# Altium project S7CAS-PLEIADES-CARTE-MERE_P20.PrjPcb (part 4 of 5)

## Sheet S7CAS-PLEIADES-CARTE-MERE_P20_ADC.SchDoc
size Tabloid; SheetNumber: 16; SheetTotal: 20; Sheet_Name: ADC; Size: 11x17
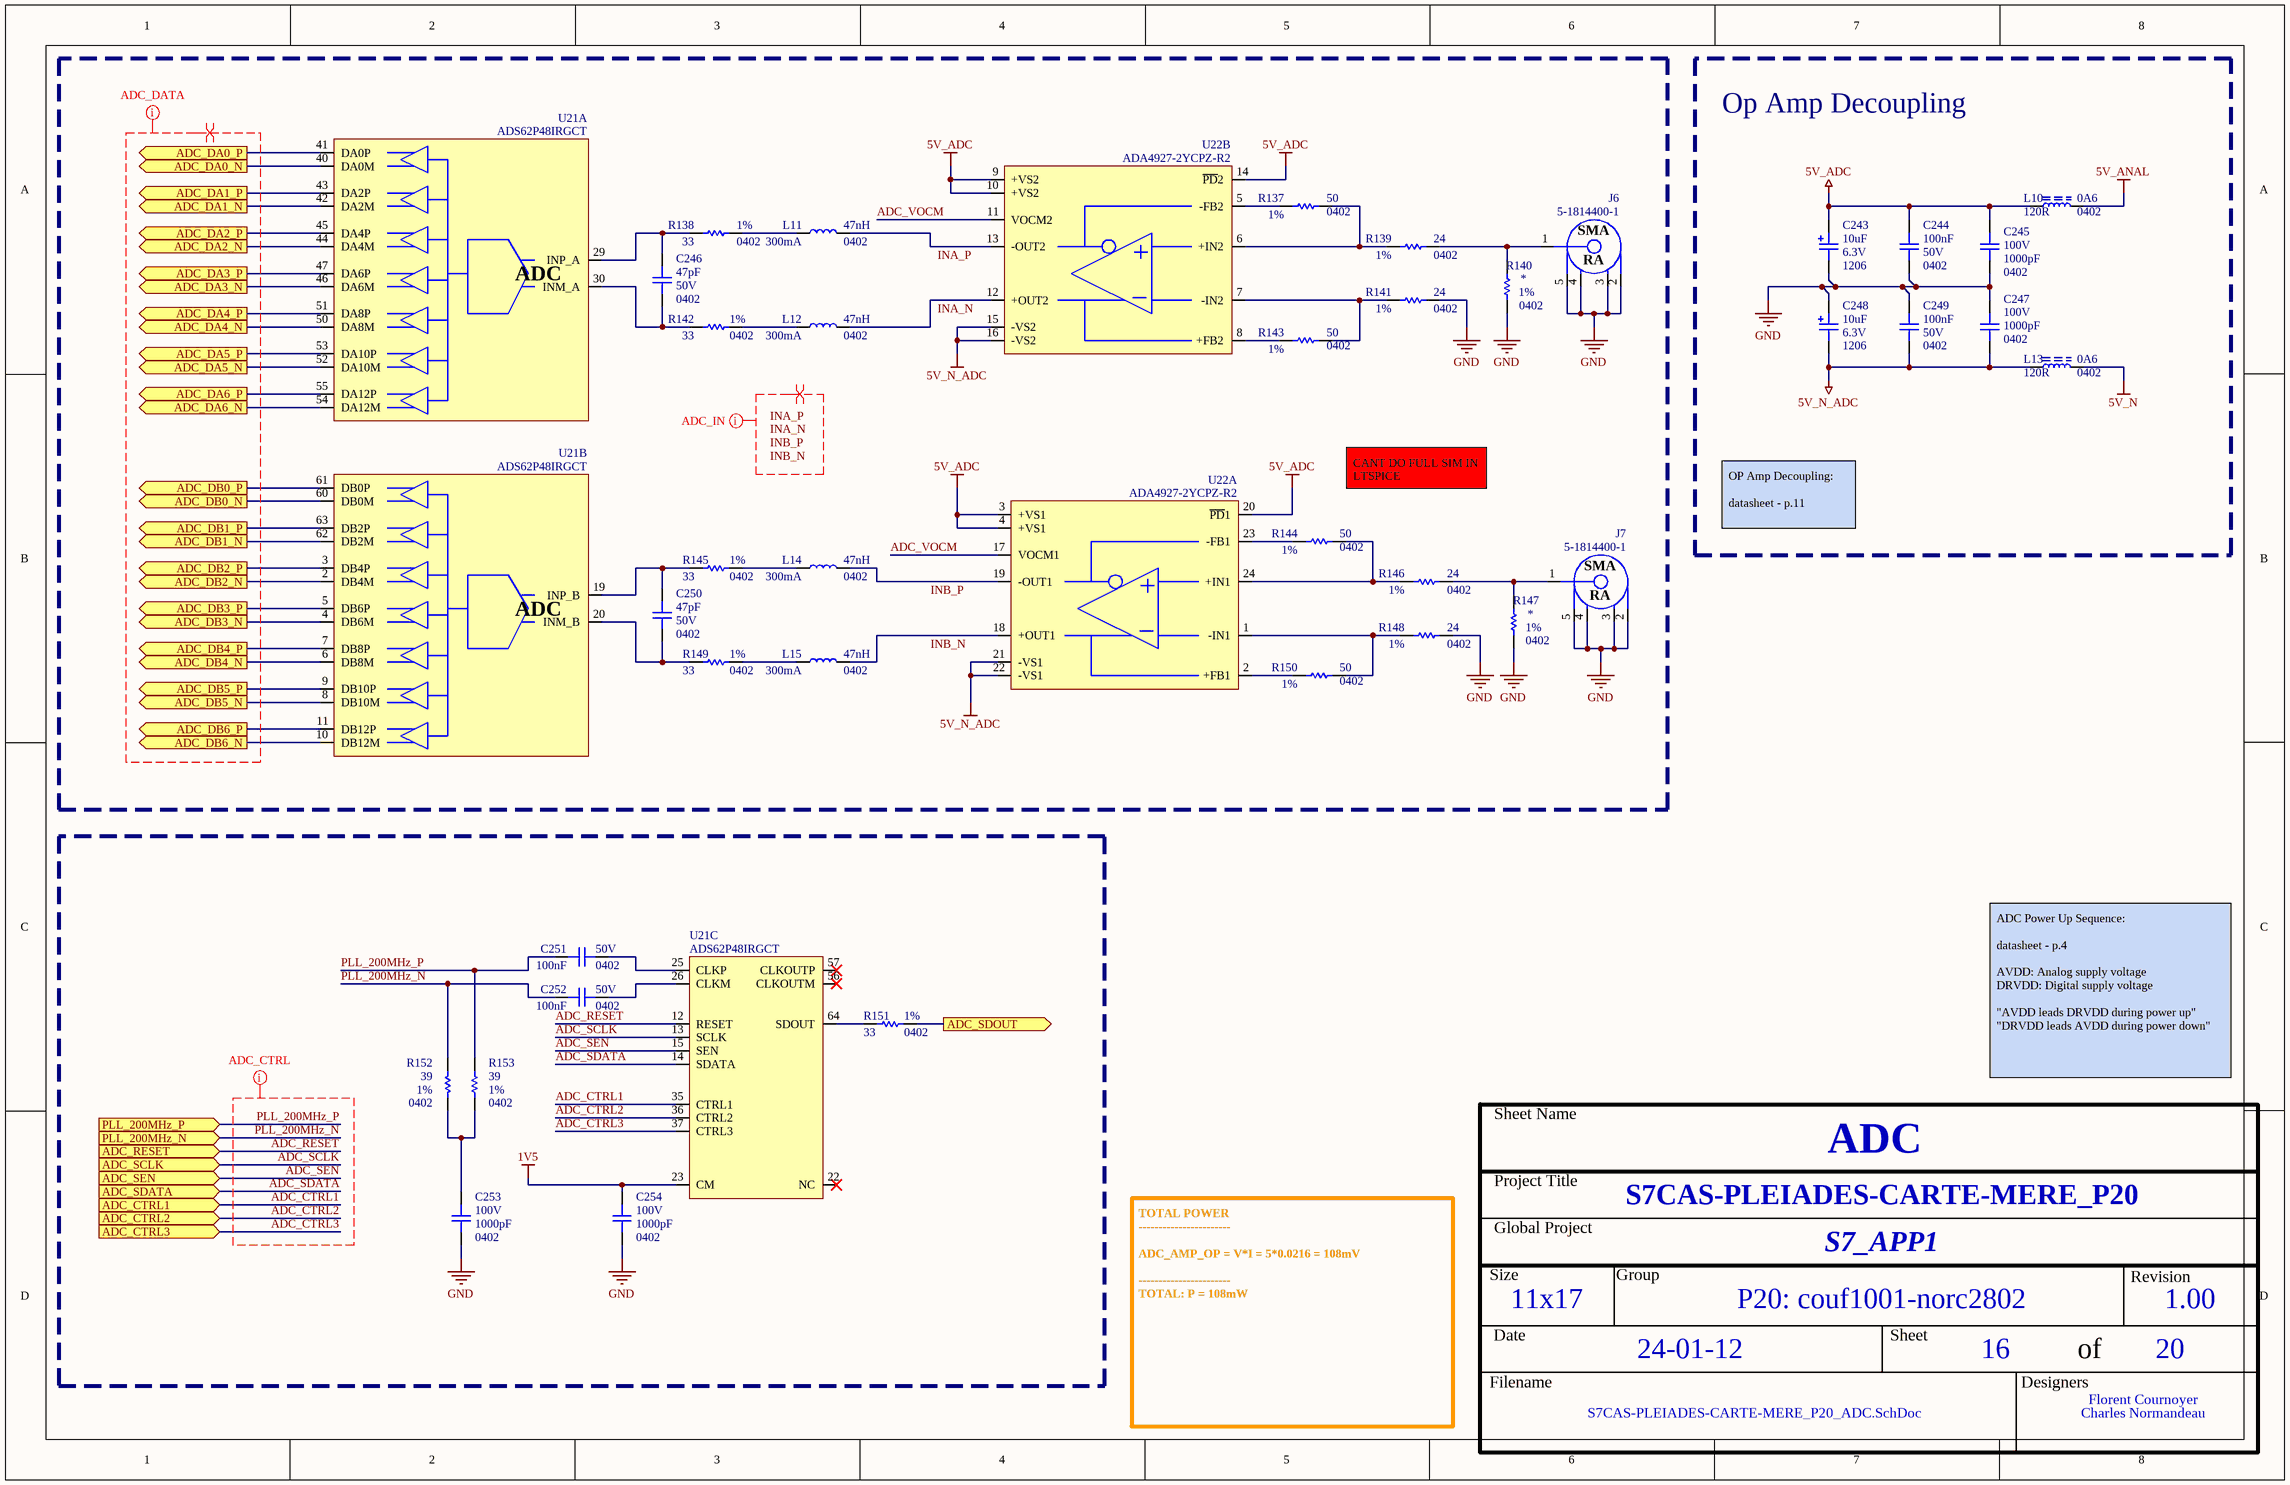
[diagram p15: S7CAS-PLEIADES-CARTE-MERE_P20_ADC.SchDoc]

### Parts
C243  value 10uF  Voltage: 6.3V  Package: 1206  [CAP_TAN_1206(A)]  (hidden comment: CAP - TANTALUM - CASE A)
C244  value 100nF  Voltage: 50V  Package: 0402  [CAP_0402]  (hidden comment: CAP - 0402)
C245  value 1000pF  Voltage: 100V  Package: 0402  [CAP_0402]  (hidden comment: CAP - 0402)
C246  value 47pF  Voltage: 50V  Package: 0402  [CAP_0402]  (hidden comment: CAP - 0402)
C247  value 1000pF  Voltage: 100V  Package: 0402  [CAP_0402]  (hidden comment: CAP - 0402)
C248  value 10uF  Voltage: 6.3V  Package: 1206  [CAP_TAN_1206(A)]  (hidden comment: CAP - TANTALUM - CASE A)
C249  value 100nF  Voltage: 50V  Package: 0402  [CAP_0402]  (hidden comment: CAP - 0402)
C250  value 47pF  Voltage: 50V  Package: 0402  [CAP_0402]  (hidden comment: CAP - 0402)
C251  value 100nF  Voltage: 50V  Package: 0402  [CAP_0402]  (hidden comment: CAP - 0402)
C252  value 100nF  Voltage: 50V  Package: 0402  [CAP_0402]  (hidden comment: CAP - 0402)
C253  value 1000pF  Voltage: 100V  Package: 0402  [CAP_0402]  (hidden comment: CAP - 0402)
C254  value 1000pF  Voltage: 100V  Package: 0402  [CAP_0402]  (hidden comment: CAP - 0402)
J6  5-1814400-1  [CONN_SMA_5-1814400-1]
J7  5-1814400-1  [CONN_SMA_5-1814400-1]
L10  value 120R  Current: 0A6  Package: 0402  [FER_0402]  (hidden comment: FER - 0402)
L11  value 47nH  Current: 300mA  Package: 0402  [IND_0402]  (hidden comment: Part Number)
L12  value 47nH  Current: 300mA  Package: 0402  [IND_0402]  (hidden comment: Part Number)
L13  value 120R  Current: 0A6  Package: 0402  [FER_0402]  (hidden comment: FER - 0402)
L14  value 47nH  Current: 300mA  Package: 0402  [IND_0402]  (hidden comment: Part Number)
L15  value 47nH  Current: 300mA  Package: 0402  [IND_0402]  (hidden comment: Part Number)
R137  value 50  Package: 0402  Precision: 1%  [RES_0402]  (hidden comment: RES - 0402)
R138  value 33  Package: 0402  Precision: 1%  [RES_0402]  (hidden comment: RES - 0402)
R139  value 24  Package: 0402  Precision: 1%  [RES_0402]  (hidden comment: RES - 0402)
R140  Package: 0402  Precision: 1%  [RES_0402]  (hidden comment: RES - 0402)
R141  value 24  Package: 0402  Precision: 1%  [RES_0402]  (hidden comment: RES - 0402)
R142  value 33  Package: 0402  Precision: 1%  [RES_0402]  (hidden comment: RES - 0402)
R143  value 50  Package: 0402  Precision: 1%  [RES_0402]  (hidden comment: RES - 0402)
R144  value 50  Package: 0402  Precision: 1%  [RES_0402]  (hidden comment: RES - 0402)
R145  value 33  Package: 0402  Precision: 1%  [RES_0402]  (hidden comment: RES - 0402)
R146  value 24  Package: 0402  Precision: 1%  [RES_0402]  (hidden comment: RES - 0402)
R147  Package: 0402  Precision: 1%  [RES_0402]  (hidden comment: RES - 0402)
R148  value 24  Package: 0402  Precision: 1%  [RES_0402]  (hidden comment: RES - 0402)
R149  value 33  Package: 0402  Precision: 1%  [RES_0402]  (hidden comment: RES - 0402)
R150  value 50  Package: 0402  Precision: 1%  [RES_0402]  (hidden comment: RES - 0402)
R151  value 33  Package: 0402  Precision: 1%  [RES_0402]  (hidden comment: RES - 0402)
R152  value 39  Package: 0402  Precision: 1%  [RES_0402]  (hidden comment: RES - 0402)
R153  value 39  Package: 0402  Precision: 1%  [RES_0402]  (hidden comment: RES - 0402)
U21  ADS62P48IRGCT  [ADC_ADS62P48IRGCT]  (parts A,B,C of 4)
U22  ADA4927-2YCPZ-R2  [OPAMP_ADA4927-2YCPZ-R2]  (parts A,B of 2)

### Blocks framed on the sheet
Op Amp Decoupling: C243-C245 C247-C249 L10 L13

### Ports
ADC_CTRL1 (in), ADC_CTRL2 (in), ADC_CTRL3 (in), ADC_DA0_N (out), ADC_DA0_P (out), ADC_DA1_N (out), ADC_DA1_P (out), ADC_DA2_N (out), ADC_DA2_P (out), ADC_DA3_N (out), ADC_DA3_P (out), ADC_DA4_N (out), ADC_DA4_P (out), ADC_DA5_N (out), ADC_DA5_P (out), ADC_DA6_N (out), ADC_DA6_P (out), ADC_DB0_N (out), ADC_DB0_P (out), ADC_DB1_N (out), ADC_DB1_P (out), ADC_DB2_N (out), ADC_DB2_P (out), ADC_DB3_N (out), ADC_DB3_P (out), ADC_DB4_N (out), ADC_DB4_P (out), ADC_DB5_N (out), ADC_DB5_P (out), ADC_DB6_N (out), ADC_DB6_P (out), ADC_RESET (in), ADC_SCLK (in), ADC_SDATA (in), ADC_SDOUT (out), ADC_SEN (in), PLL_200MHz_N (in), PLL_200MHz_P (in)

### Nets
1V5: C254.1 U21.23(CM)
5V_ADC: C243.2 C244.2 C245.1 L10.2 U22.3(+VS1) U22.4(+VS1) U22.9(+VS2) U22.10(+VS2) U22.14(~{PD}2) U22.20(~{PD}1)
5V_ANAL: L10.1
5V_N: L13.1
5V_N_ADC: C247.2 C248.1 C249.1 L13.2 U22.15(-VS2) U22.16(-VS2) U22.21(-VS1) U22.22(-VS1)
GND: C243.1 C244.1 C245.2 C247.1 C248.2 C249.2 C253.2 C254.2 J6.2 J6.3 J6.4 J6.5 J7.2 J7.3 J7.4 J7.5 R140.1 R141.1 R147.1 R148.1
ADC_CTRL1: U21.35(CTRL1) ; port ADC_CTRL1
ADC_CTRL2: U21.36(CTRL2) ; port ADC_CTRL2
ADC_CTRL3: U21.37(CTRL3) ; port ADC_CTRL3
ADC_DA0_N: U21.40(DA0M) ; port ADC_DA0_N
ADC_DA0_P: U21.41(DA0P) ; port ADC_DA0_P
ADC_DA1_N: U21.42(DA2M) ; port ADC_DA1_N
ADC_DA1_P: U21.43(DA2P) ; port ADC_DA1_P
ADC_DA2_N: U21.44(DA4M) ; port ADC_DA2_N
ADC_DA2_P: U21.45(DA4P) ; port ADC_DA2_P
ADC_DA3_N: U21.46(DA6M) ; port ADC_DA3_N
ADC_DA3_P: U21.47(DA6P) ; port ADC_DA3_P
ADC_DA4_N: U21.50(DA8M) ; port ADC_DA4_N
ADC_DA4_P: U21.51(DA8P) ; port ADC_DA4_P
ADC_DA5_N: U21.52(DA10M) ; port ADC_DA5_N
ADC_DA5_P: U21.53(DA10P) ; port ADC_DA5_P
ADC_DA6_N: U21.54(DA12M) ; port ADC_DA6_N
ADC_DA6_P: U21.55(DA12P) ; port ADC_DA6_P
ADC_DB0_N: U21.60(DB0M) ; port ADC_DB0_N
ADC_DB0_P: U21.61(DB0P) ; port ADC_DB0_P
ADC_DB1_N: U21.62(DB2M) ; port ADC_DB1_N
ADC_DB1_P: U21.63(DB2P) ; port ADC_DB1_P
ADC_DB2_N: U21.2(DB4M) ; port ADC_DB2_N
ADC_DB2_P: U21.3(DB4P) ; port ADC_DB2_P
ADC_DB3_N: U21.4(DB6M) ; port ADC_DB3_N
ADC_DB3_P: U21.5(DB6P) ; port ADC_DB3_P
ADC_DB4_N: U21.6(DB8M) ; port ADC_DB4_N
ADC_DB4_P: U21.7(DB8P) ; port ADC_DB4_P
ADC_DB5_N: U21.8(DB10M) ; port ADC_DB5_N
ADC_DB5_P: U21.9(DB10P) ; port ADC_DB5_P
ADC_DB6_N: U21.10(DB12M) ; port ADC_DB6_N
ADC_DB6_P: U21.11(DB12P) ; port ADC_DB6_P
ADC_RESET: U21.12(RESET) ; port ADC_RESET
ADC_SCLK: U21.13(SCLK) ; port ADC_SCLK
ADC_SDATA: U21.14(SDATA) ; port ADC_SDATA
ADC_SDOUT: R151.1 ; port ADC_SDOUT
ADC_SEN: U21.15(SEN) ; port ADC_SEN
ADC_VOCM: U22.11(VOCM2) U22.17(VOCM1)
INA_N: L12.2 U22.12(+OUT2)
INA_P: L11.2 U22.13(-OUT2)
INB_N: L15.2 U22.18(+OUT1)
INB_P: L14.2 U22.19(-OUT1)
PLL_200MHz_N: C252.2 R152.2 ; port PLL_200MHz_N
PLL_200MHz_P: C251.2 R153.2 ; port PLL_200MHz_P
NetC246_1: C246.1 R142.2 U21.30(INM_A)
NetC246_2: C246.2 R138.2 U21.29(INP_A)
NetC250_1: C250.1 R149.2 U21.20(INM_B)
NetC250_2: C250.2 R145.2 U21.19(INP_B)
NetC251_1: C251.1 U21.25(CLKP)
NetC252_1: C252.1 U21.26(CLKM)
NetC253_1: C253.1 R152.1 R153.1
NetJ6_1: J6.1 R139.1 R140.2
NetJ7_1: J7.1 R146.1 R147.2
NetL11_1: L11.1 R138.1
NetL12_1: L12.1 R142.1
NetL14_1: L14.1 R145.1
NetL15_1: L15.1 R149.1
NetR137_1: R137.1 R139.2 U22.6(+IN2)
NetR137_2: R137.2 U22.5(-FB2)
NetR141_2: R141.2 R143.1 U22.7(-IN2)
NetR143_2: R143.2 U22.8(+FB2)
NetR144_1: R144.1 R146.2 U22.24(+IN1)
NetR144_2: R144.2 U22.23(-FB1)
NetR148_2: R148.2 R150.1 U22.1(-IN1)
NetR150_2: R150.2 U22.2(+FB1)
NetR151_2: R151.2 U21.64(SDOUT)

Not connected (* = marked no-connect by the designer): U21 22(NC)* 56(CLKOUTM)* 57(CLKOUTP)*

### Layout directives
net class TRACKS_50: (no net found under the mark), ADC_CTRL1, ADC_CTRL2, ADC_CTRL3, ADC_RESET, ADC_SCLK, ADC_SDATA, ADC_SEN, INA_N, INA_P, INB_N, INB_P, PLL_200MHz_N, PLL_200MHz_P
differential pair: (no net found under the mark), INA_N, INA_P, INB_N, INB_P

### Notes on the sheet
- CANT DO FULL SIM IN LTSPICE
- OP Amp Decoupling:
  datasheet - p.11
- ADC Power Up Sequence:
  datasheet - p.4
  AVDD: Analog supply voltage
  DRVDD: Digital supply voltage
  "AVDD leads DRVDD during power up"
  "DRVDD leads AVDD during power down"
- TOTAL POWER
  -----------------------
  ADC_AMP_OP = V*I = 5*0.0216 = 108mV
  -----------------------
  TOTAL: P = 108mW
- Labels drawn without touching a wire or pin: INA_N, INA_P, INB_N, INB_P
- Sheet Name
- Project Title
- Global Project
- Size
- Group
- Revision
- Date
- Sheet
- of
- Filename
- Designers
- (in symbol ADC_ADS62P48IRGCT, part A) ADC
- (in symbol ADC_ADS62P48IRGCT, part B) ADC
- (in symbol CONN_SMA_5-1814400-1) SMA; RA

### Library data of the parts
C243 C248 = CAP_TANT_1206(A): CAP - TANTALUM - 1206; Mfg Part Number: TBD; Precision: 10%; Current: *; HelpURL: TBD; CreatedBy: Jonathan Bouchard; Power: *
C244 C249 C251 C252 = CAP - 0402: Mfg Part Number: GRM155R61H104KE14; Precision: 10%; Current: *; CreatedBy: Jonathan Bouchard; Power: *
C245 C247 C253 C254 = CAP - 0402: as C226-C228 on sheet S7CAS-PLEIADES-CARTE-MERE_P20_DAC; Current: *; CreatedBy: Jonathan Bouchard; Power: *
C246 C250 = CAP - 0402: Mfg Part Number: GRM1555C1H470GA01; Precision: 10%; Current: *; CreatedBy: Jonathan Bouchard; Power: *
J6 J7 = CONN_SMA_5-1814400-1: CONN -  SMA JACK R/A 50 OHM - TH; Mfg: TE Connectivity AMP Connectors; Voltage: *; Current: *; Power: *; Mfg Part Number: 5-1814400-1; HelpURL: http://www.te.com/commerce/DocumentDelivery/DDEController?Action=srchrtrv&DocNm=1814400&DocType=Customer+Drawing&DocLang=English; CreatedBy: Jonathan Bouchard; Temperature: -55°C ~ 85°C; Value: *; Precision: *; Package: TH-5; Supplier 1: Digikey; Supplier Part Number 1: A97593-ND
L10 L13 = FER - 0402: Mfg Part Number: BLM15BX121SN1; Voltage: *; CreatedBy: Jonathan Bouchard; Power: *; Precision: *
L11 L12 L14 L15 = IND - 0402: Mfg Part Number: TBD; Voltage: *
R137 R143 R144 R150 = RES - 0402: Mfg Part Number: FC0402E50R0FTBST0; Voltage: 50V; Power: 1/16W; Current: *; CreatedBy: Jonathan Bouchard
R138 R142 R145 R149 R151 = RES - 0402: Mfg Part Number: CRCW040233R0FKEDC; Voltage: 50V; Power: 1/16W; Current: *; CreatedBy: Jonathan Bouchard
R139 R141 R146 R148 = RES - 0402: Mfg Part Number: MCS04020C2409FE000; Voltage: 50V; Power: 1/16W; Current: *; CreatedBy: Jonathan Bouchard
R140 R147 = RES - 0402: Voltage: 50V; Power: 1/16W; Current: *; CreatedBy: Jonathan Bouchard; Value: *
R152 R153 = RES - 0402: Mfg Part Number: RL0510S-390-F; Voltage: 50; Power: 1/16W; Current: *; CreatedBy: Jonathan Bouchard
U21 = ADC_ADS62P48IRGCT: ADC - 14 BIT 210MSPS SUAL - VQFN-64; Voltage: 3.15 V ~ 3.6 V / 1.7 V ~ 1.9 V; Mfg: Texas Instruments; Precision: 14 Bit; Current: *; Power: *; Mfg Part Number: ADS62P48IRGCT; HelpURL: http://www.ti.com/lit/ds/symlink/ads62p48.pdf; CreatedBy: Jonathan Bouchard; Temperature: -40°C ~ 85°C; Value: *; Package: VQFN-64; Supplier 1: Digikey; Supplier Part Number 1: 296-24611-1-ND
U22 = OPAMP_ADA4927-2YCPZ-R2: OPAMP - CFA 2.3GHZ - QFN-24; Voltage: 4.5 V ~ 11 V, ±2.25 V ~ 5.5 V; Current: 65mA; Mfg: Analog Devices; Power: *; Mfg Part Number: ADA4927-2YCPZ-R2; HelpURL: http://www.analog.com/media/en/technical-documentation/data-sheets/ADA4927-1_4927-2.pdf; CreatedBy: Jonathan Bouchard; Temperature: -40°C ~ 105°C; Value: *; Precision: *; Package: QFN-24; Supplier 1: Digikey; Supplier Part Number 1: ADA4927-2YCPZ-R2CT-ND

## Sheet S7CAS-PLEIADES-CARTE-MERE_P20_DAC-ADC-Spice-Models.SchDoc
size Tabloid; SheetNumber: 18; SheetTotal: 21; Sheet_Name: DAC ADC Spice Models; Size: 11x17
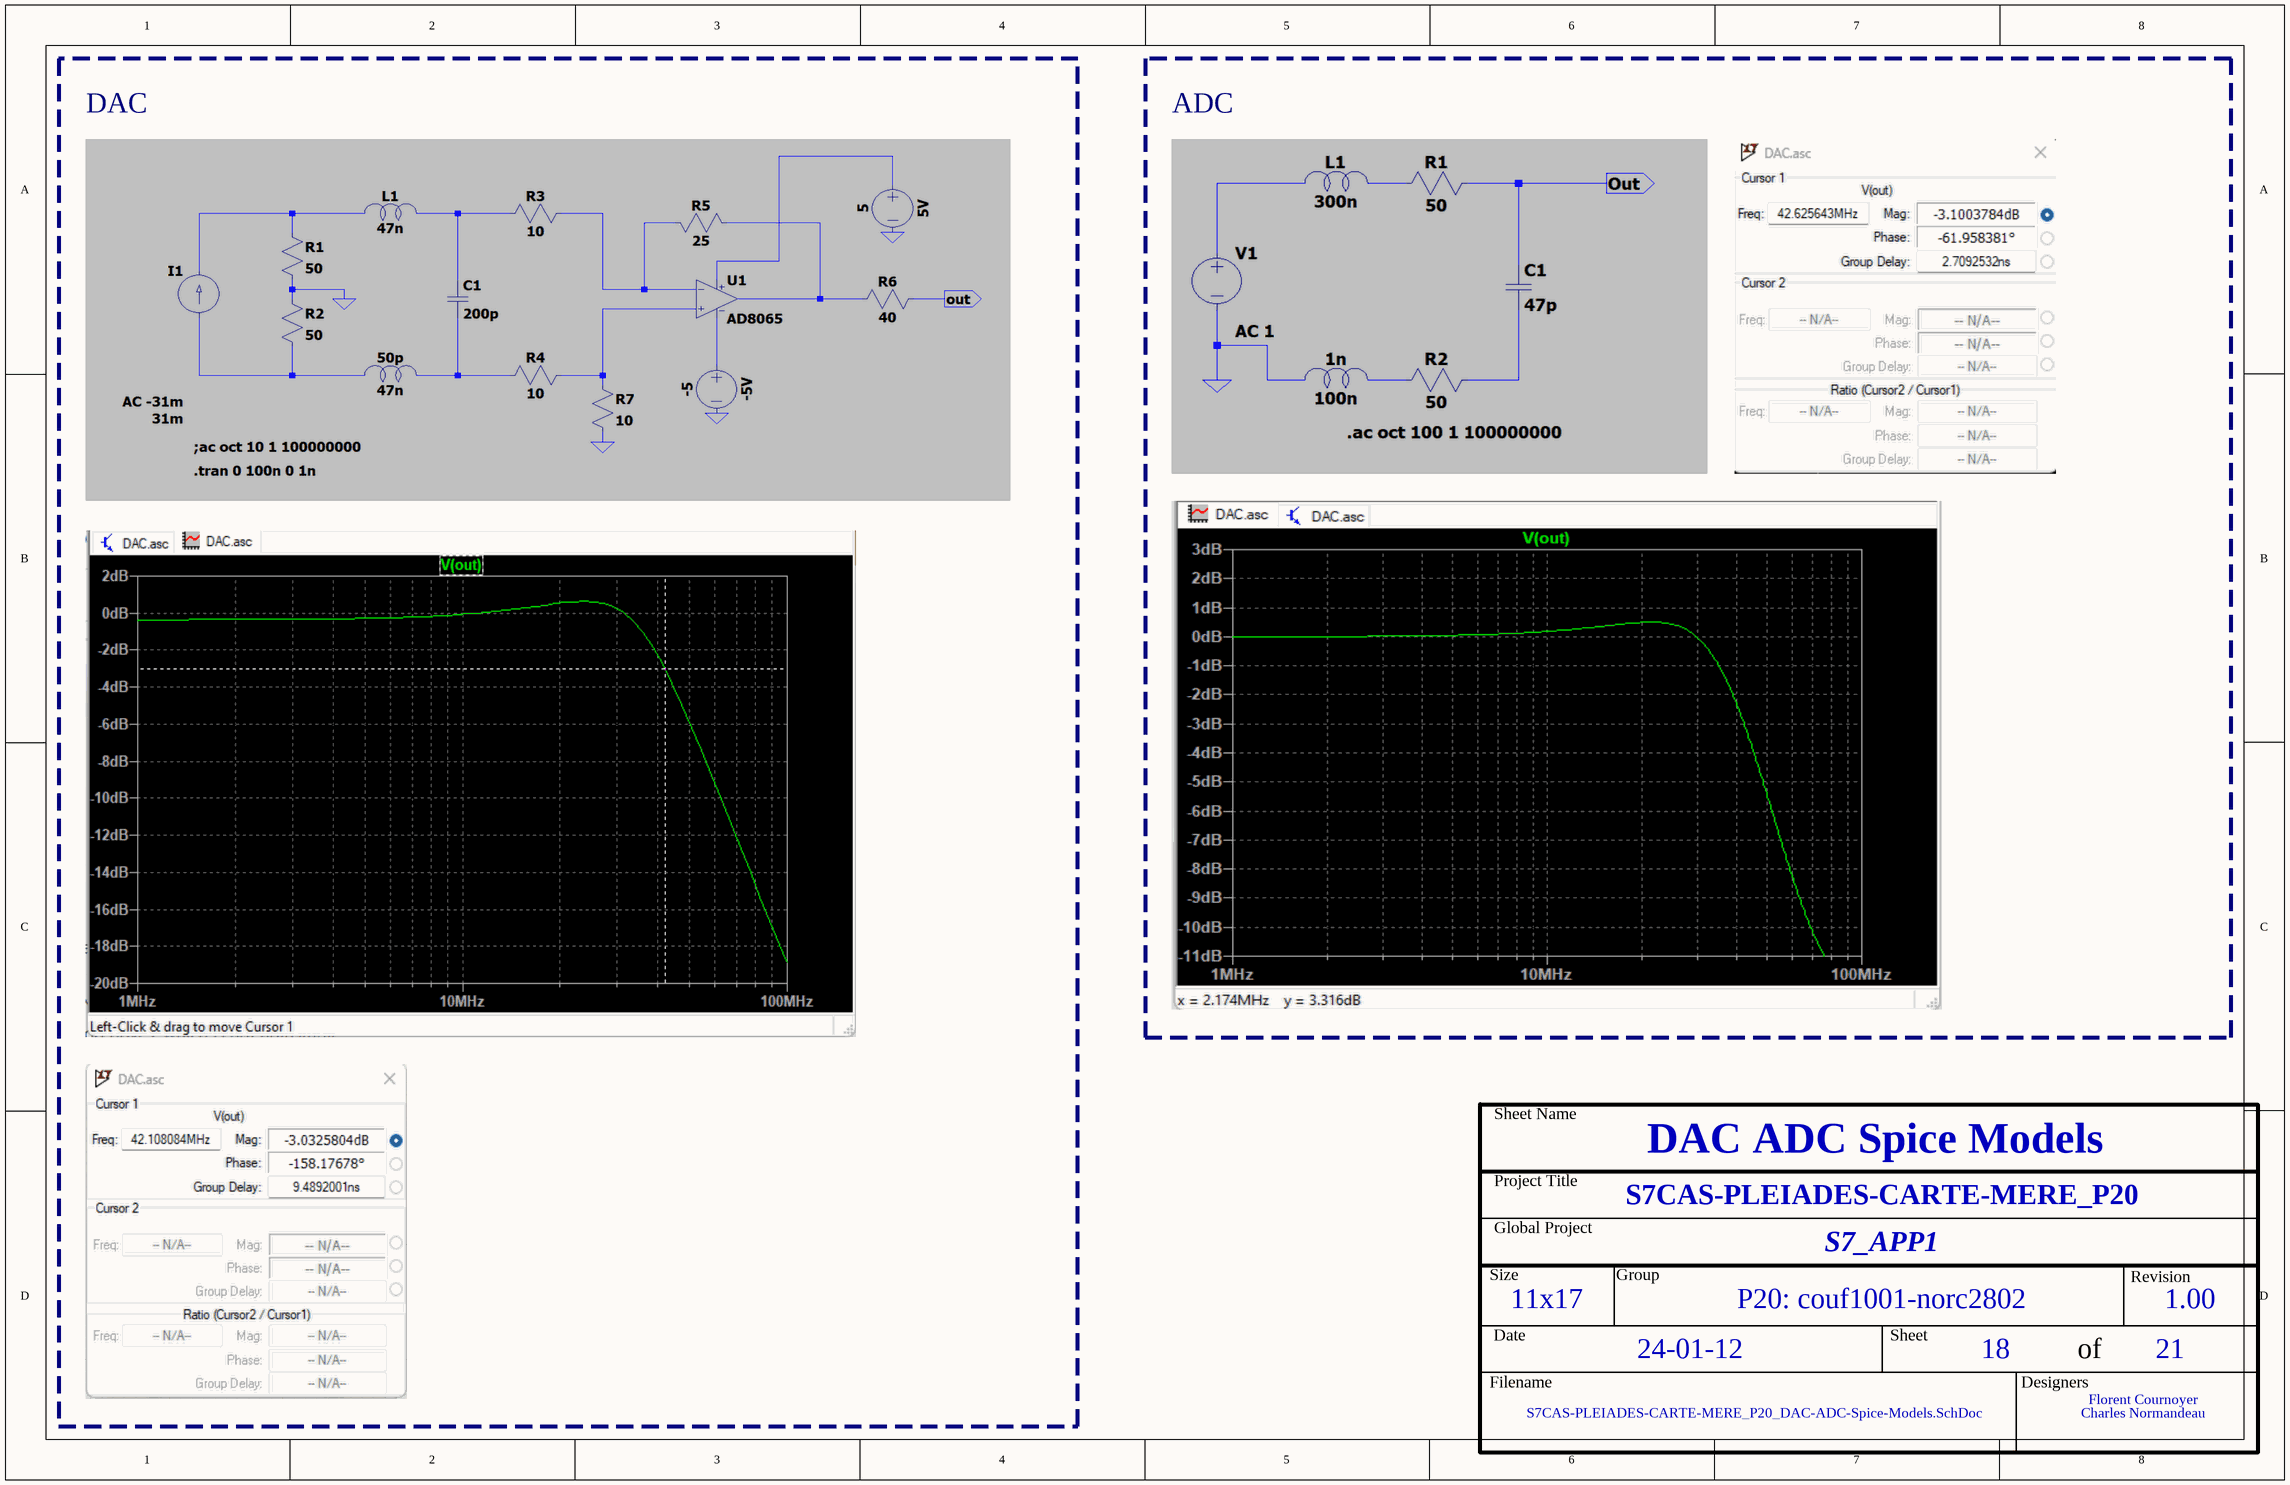
[diagram p16: S7CAS-PLEIADES-CARTE-MERE_P20_DAC-ADC-Spice-Models.SchDoc]

### Notes on the sheet
- DAC
- ADC
- Sheet Name
- Project Title
- Global Project
- Size
- Group
- Revision
- Date
- Sheet
- of
- Filename
- Designers

## Sheet S7CAS-PLEIADES-CARTE-MERE_P20_DAC-ADC-Decoupling.SchDoc
size Tabloid; SheetNumber: 18; SheetTotal: 20; Sheet_Name: DAC ADC Decoupling; Size: 11x17
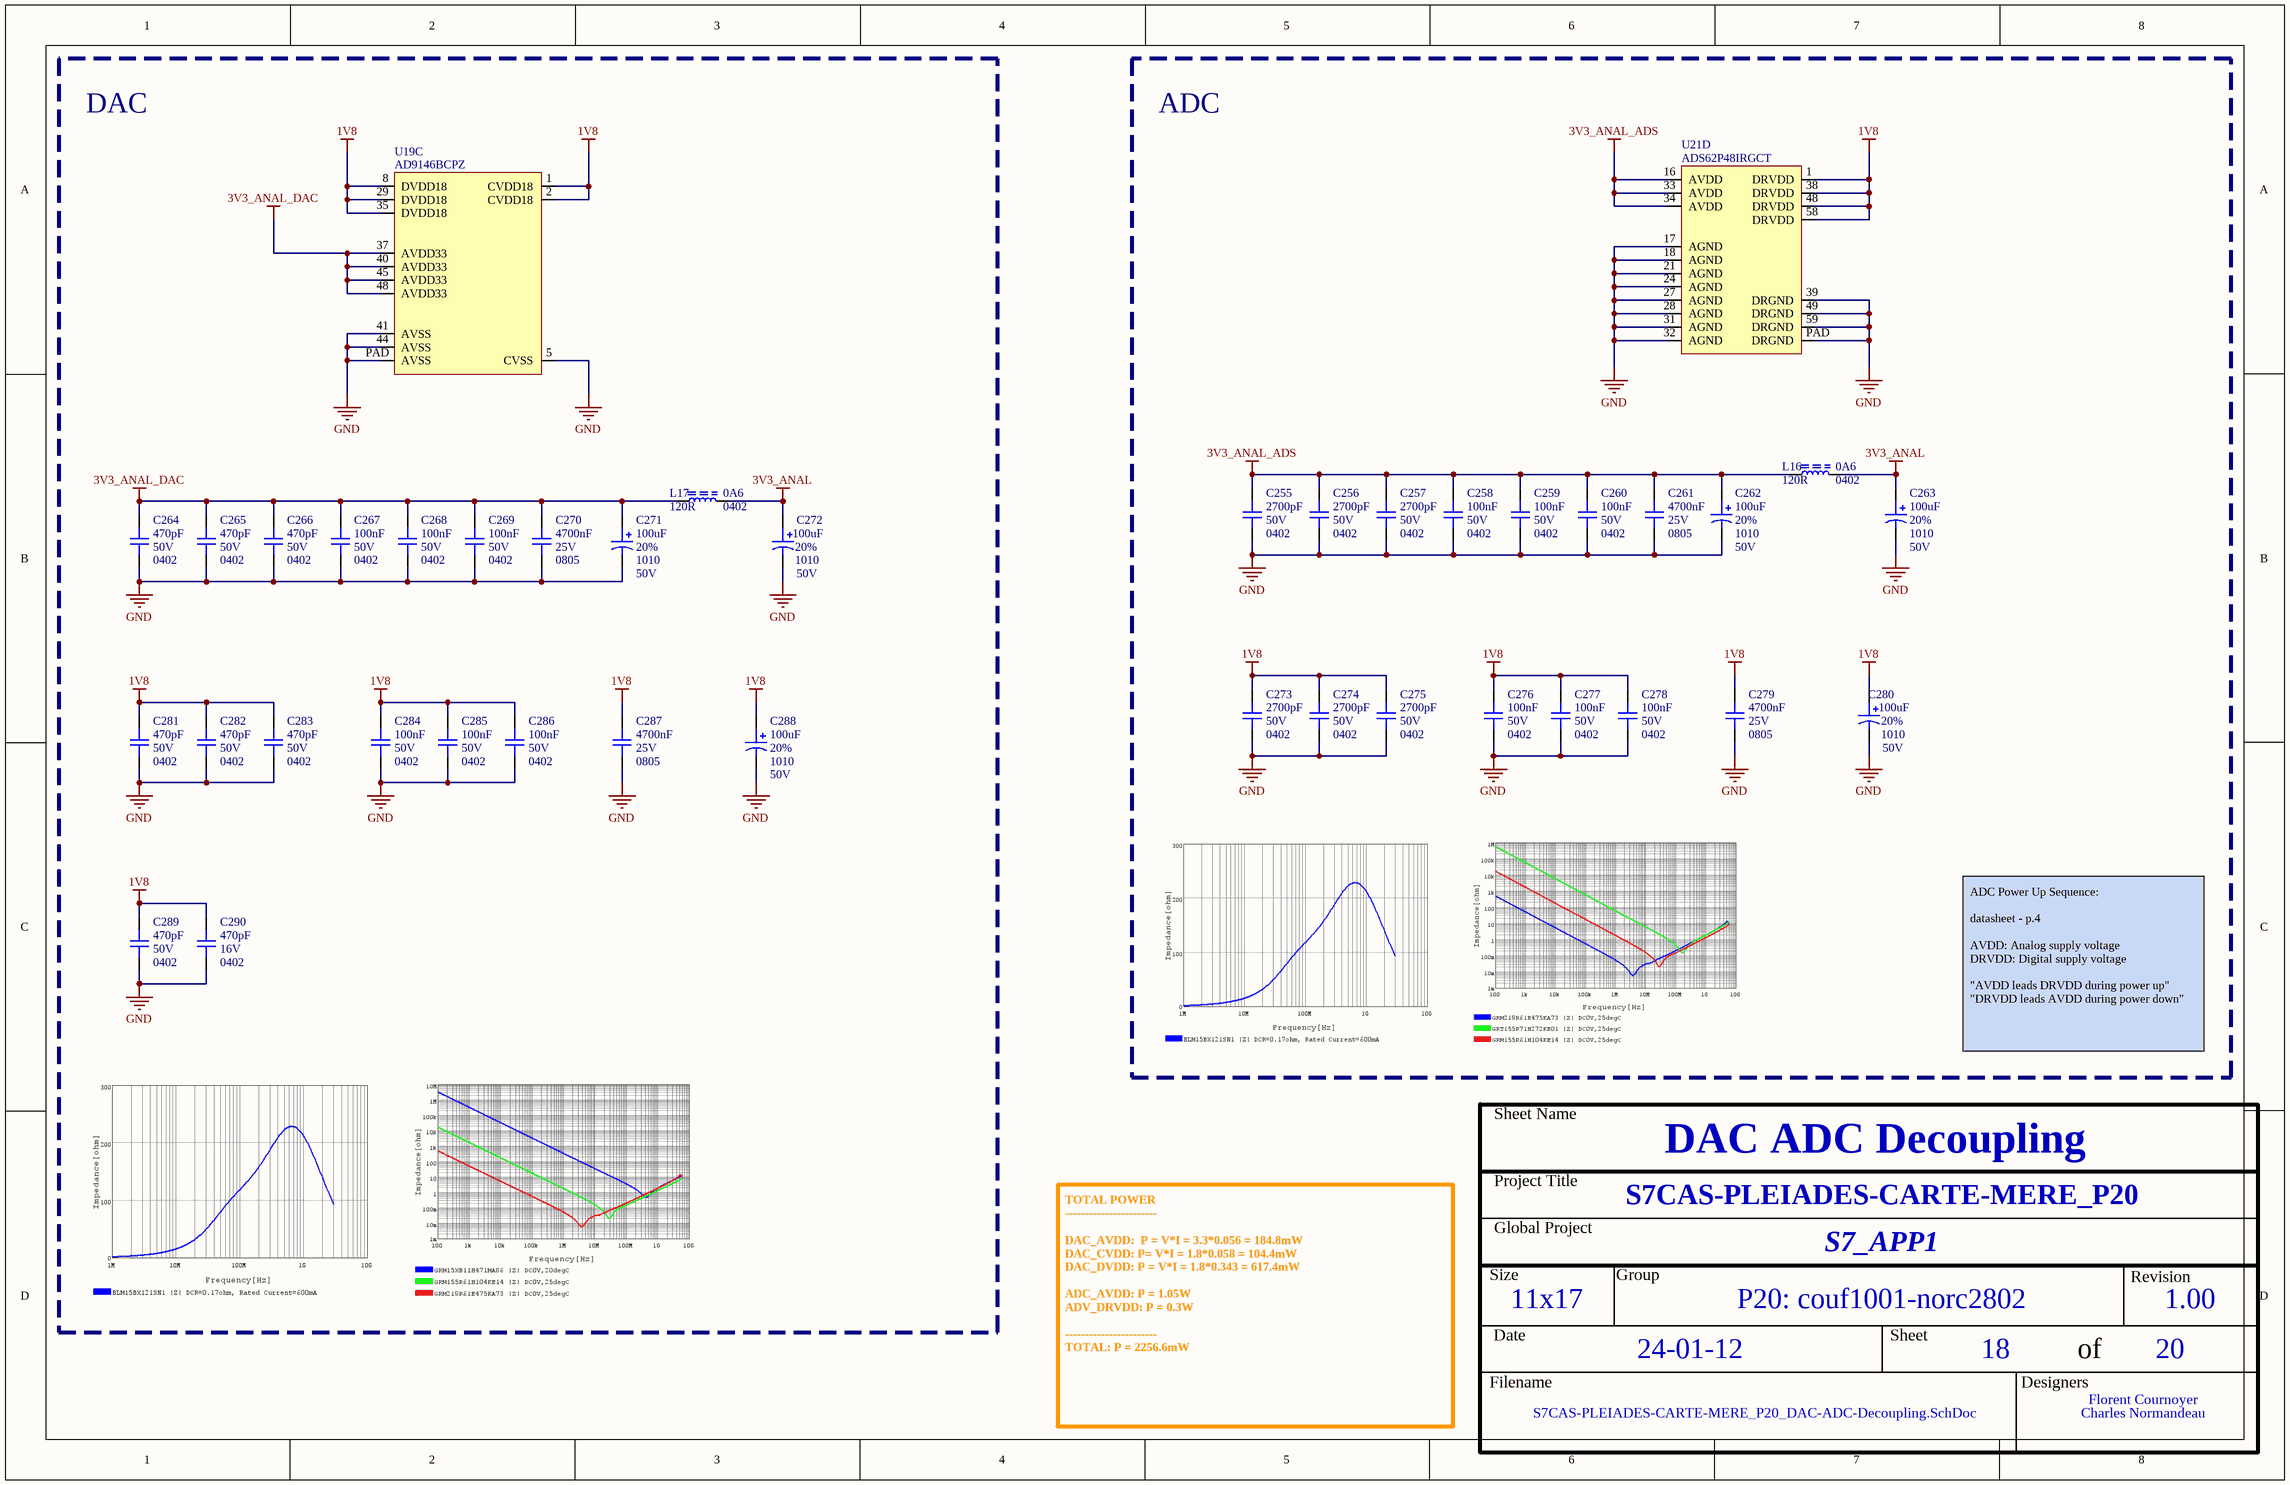
[diagram p17: S7CAS-PLEIADES-CARTE-MERE_P20_DAC-ADC-Decoupling.SchDoc]

### Parts
C255  value 2700pF  Voltage: 50V  Package: 0402  [CAP_0402]  (hidden comment: CAP - 0402)
C256  value 2700pF  Voltage: 50V  Package: 0402  [CAP_0402]  (hidden comment: CAP - 0402)
C257  value 2700pF  Voltage: 50V  Package: 0402  [CAP_0402]  (hidden comment: CAP - 0402)
C258  value 100nF  Voltage: 50V  Package: 0402  [CAP_0402]  (hidden comment: CAP - 0402)
C259  value 100nF  Voltage: 50V  Package: 0402  [CAP_0402]  (hidden comment: CAP - 0402)
C260  value 100nF  Voltage: 50V  Package: 0402  [CAP_0402]  (hidden comment: CAP - 0402)
C261  value 4700nF  Voltage: 25V  Package: 0805  [CAP_0805]  (hidden comment: CAP - 0805)
C262  value 100uF  Voltage: 50V  Package: 1010  Precision: 20%  [CAP_ALU_1010_vishay]  (hidden comment: MAL215099101E3)
C263  value 100uF  Voltage: 50V  Package: 1010  Precision: 20%  [CAP_ALU_1010_vishay]  (hidden comment: MAL215099101E3)
C264  value 470pF  Voltage: 50V  Package: 0402  [CAP_0402]  (hidden comment: CAP - 0402)
C265  value 470pF  Voltage: 50V  Package: 0402  [CAP_0402]  (hidden comment: CAP - 0402)
C266  value 470pF  Voltage: 50V  Package: 0402  [CAP_0402]  (hidden comment: CAP - 0402)
C267  value 100nF  Voltage: 50V  Package: 0402  [CAP_0402]  (hidden comment: CAP - 0402)
C268  value 100nF  Voltage: 50V  Package: 0402  [CAP_0402]  (hidden comment: CAP - 0402)
C269  value 100nF  Voltage: 50V  Package: 0402  [CAP_0402]  (hidden comment: CAP - 0402)
C270  value 4700nF  Voltage: 25V  Package: 0805  [CAP_0805]  (hidden comment: CAP - 0805)
C271  value 100uF  Voltage: 50V  Package: 1010  Precision: 20%  [CAP_ALU_1010_vishay]  (hidden comment: MAL215099101E3)
C272  value 100uF  Voltage: 50V  Package: 1010  Precision: 20%  [CAP_ALU_1010_vishay]  (hidden comment: MAL215099101E3)
C273  value 2700pF  Voltage: 50V  Package: 0402  [CAP_0402]  (hidden comment: CAP - 0402)
C274  value 2700pF  Voltage: 50V  Package: 0402  [CAP_0402]  (hidden comment: CAP - 0402)
C275  value 2700pF  Voltage: 50V  Package: 0402  [CAP_0402]  (hidden comment: CAP - 0402)
C276  value 100nF  Voltage: 50V  Package: 0402  [CAP_0402]  (hidden comment: CAP - 0402)
C277  value 100nF  Voltage: 50V  Package: 0402  [CAP_0402]  (hidden comment: CAP - 0402)
C278  value 100nF  Voltage: 50V  Package: 0402  [CAP_0402]  (hidden comment: CAP - 0402)
C279  value 4700nF  Voltage: 25V  Package: 0805  [CAP_0805]  (hidden comment: CAP - 0805)
C280  value 100uF  Voltage: 50V  Package: 1010  Precision: 20%  [CAP_ALU_1010_vishay]  (hidden comment: MAL215099101E3)
C281  value 470pF  Voltage: 50V  Package: 0402  [CAP_0402]  (hidden comment: CAP - 0402)
C282  value 470pF  Voltage: 50V  Package: 0402  [CAP_0402]  (hidden comment: CAP - 0402)
C283  value 470pF  Voltage: 50V  Package: 0402  [CAP_0402]  (hidden comment: CAP - 0402)
C284  value 100nF  Voltage: 50V  Package: 0402  [CAP_0402]  (hidden comment: CAP - 0402)
C285  value 100nF  Voltage: 50V  Package: 0402  [CAP_0402]  (hidden comment: CAP - 0402)
C286  value 100nF  Voltage: 50V  Package: 0402  [CAP_0402]  (hidden comment: CAP - 0402)
C287  value 4700nF  Voltage: 25V  Package: 0805  [CAP_0805]  (hidden comment: CAP - 0805)
C288  value 100uF  Voltage: 50V  Package: 1010  Precision: 20%  [CAP_ALU_1010_vishay]  (hidden comment: MAL215099101E3)
C289  value 470pF  Voltage: 50V  Package: 0402  [CAP_0402]  (hidden comment: CAP - 0402)
C290  value 470pF  Voltage: 16V  Package: 0402  [CAP_0402]  (hidden comment: CAP - 0402)
L16  value 120R  Current: 0A6  Package: 0402  [FER_0402]  (hidden comment: FER - 0402)
L17  value 120R  Current: 0A6  Package: 0402  [FER_0402]  (hidden comment: FER - 0402)
U19  AD9146BCPZ  [DAC_AD9146BCPZ]  (part C of 3)
U21  ADS62P48IRGCT  [ADC_ADS62P48IRGCT]  (part D of 4)

### Blocks framed on the sheet
DAC: C264-C272 C281-C290 L17 U19
ADC: C255-C263 C273-C280 L16 U21

### Nets
1V8: C273.2 C274.2 C275.2 C276.2 C277.2 C278.2 C279.2 C280.1 C281.2 C282.2 C283.2 C284.2 C285.2 C286.2 C287.2 C288.1 C289.2 C290.2 U19.1(CVDD18) U19.2(CVDD18) U19.8(DVDD18) U19.29(DVDD18) U19.35(DVDD18) U21.1(DRVDD) U21.38(DRVDD) U21.48(DRVDD) U21.58(DRVDD)
3V3_ANAL: C263.1 C272.1 L16.1 L17.1
3V3_ANAL_ADS: C255.2 C256.2 C257.2 C258.2 C259.2 C260.2 C261.2 C262.1 L16.2 U21.16(AVDD) U21.33(AVDD) U21.34(AVDD)
3V3_ANAL_DAC: C264.2 C265.2 C266.2 C267.2 C268.2 C269.2 C270.2 C271.1 L17.2 U19.37(AVDD33) U19.40(AVDD33) U19.45(AVDD33) U19.48(AVDD33)
GND: C255.1 C256.1 C257.1 C258.1 C259.1 C260.1 C261.1 C262.2 C263.2 C264.1 C265.1 C266.1 C267.1 C268.1 C269.1 C270.1 C271.2 C272.2 C273.1 C274.1 C275.1 C276.1 C277.1 C278.1 C279.1 C280.2 C281.1 C282.1 C283.1 C284.1 C285.1 C286.1 C287.1 C288.2 C289.1 C290.1 U19.5(CVSS) U19.41(AVSS) U19.44(AVSS) U19.PAD(AVSS) U21.17(AGND) U21.18(AGND) U21.21(AGND) U21.24(AGND) U21.27(AGND) U21.28(AGND) U21.31(AGND) U21.32(AGND) U21.39(DRGND) U21.49(DRGND) U21.59(DRGND) U21.PAD(DRGND)

### Notes on the sheet
- ADC Power Up Sequence:
  datasheet - p.4
  AVDD: Analog supply voltage
  DRVDD: Digital supply voltage
  "AVDD leads DRVDD during power up"
  "DRVDD leads AVDD during power down"
- TOTAL POWER
  -----------------------
  DAC_AVDD:  P = V*I = 3.3*0.056 = 184.8mW
  DAC_CVDD: P= V*I = 1.8*0.058 = 104.4mW
  DAC_DVDD: P = V*I = 1.8*0.343 = 617.4mW
  ADC_AVDD: P = 1.05W
  ADV_DRVDD: P = 0.3W
  -----------------------
  TOTAL: P = 2256.6mW
- Sheet Name
- Project Title
- Global Project
- Size
- Group
- Revision
- Date
- Sheet
- of
- Filename
- Designers

### Library data of the parts
C255-C257 C273-C275 = CAP - 0402: Mfg Part Number: GRT155R71H272KE01; Precision: 10%; Current: *; CreatedBy: Jonathan Bouchard; Power: *
C258-C260 C267-C269 C276-C278 C284-C286 = CAP - 0402: as C244 on sheet S7CAS-PLEIADES-CARTE-MERE_P20_ADC; Current: *; CreatedBy: Jonathan Bouchard; Power: *
C261 C270 C279 C287 = CAP - 0805: Mfg Part Number: GRM219R61E475KA73; Precision: 10%; Current: *; CreatedBy: Jonathan Bouchard; Power: *
C262 C263 C271 C272 C280 C288 = CAP_ALU_MAL215099101E3: CAP - ALU 100uF 20% 50V - 1010; Current: 490mA; Mfg: Vishay Dale; Mfg Part Number: MAL215099101E3; HelpURL: http://www.vishay.com/docs/28395/150crz.pdf; CreatedBy: Jonathan Bouchard; Temperature: -55°C to 125°C; Power: *; Supplier 1: Digikey; Supplier Part Number 1: 4399PHDKR-ND
C264-C266 C281-C283 C289 = CAP - 0402: Mfg Part Number: GRM1555C1H471GA01; Precision: 2%; Current: *; HelpURL: https://search.murata.co.jp/Ceramy/image/img/A01X/G101/ENG/GRM1555C1H471GA01-01.pdf; CreatedBy: Jonathan Bouchard; Power: *
C290 = CAP - 0402: Mfg Part Number: GRM15XB11H471MA86; Precision: 10%; Current: *; CreatedBy: Jonathan Bouchard; Power: *
L16 L17 = FER - 0402: Mfg Part Number: BLM15BX121SN1; Voltage: *; CreatedBy: Jonathan Bouchard; Power: *; Precision: *
U19 = DAC_AD9146BCPZ: DAC - 16BIT SRL HIGH SPEED - QFN-48; Voltage: 3.13 V ~ 3.47 V / 1.71 V ~ 1.89 V; Mfg: Analog Devices Inc.; Current: *; Power: *; Mfg Part Number: AD9146BCPZ; HelpURL: http://www.analog.com/media/en/technical-documentation/data-sheets/AD9146.PDF; CreatedBy: Jonathan Bouchard; Temperature: -40°C ~ 85°C; Value: *; Precision: 16 Bit; Package: QFN-48; Supplier 1: Digikey; Supplier Part Number 1: AD9146BCPZ-ND
U21 = ADC_ADS62P48IRGCT: as U21 on sheet S7CAS-PLEIADES-CARTE-MERE_P20_ADC; Current: *; Power: *; Mfg Part Number: ADS62P48IRGCT; HelpURL: http://www.ti.com/lit/ds/symlink/ads62p48.pdf; CreatedBy: Jonathan Bouchard; Temperature: -40°C ~ 85°C; Value: *; Package: VQFN-64; Supplier 1: Digikey; Supplier Part Number 1: 296-24611-1-ND

## Sheet S7CAS-PLEIADES-CARTE-MERE_P20_Motor.SchDoc
size Tabloid; SheetNumber: 19; SheetTotal: 20; Sheet_Name: Motor; Size: 11x17
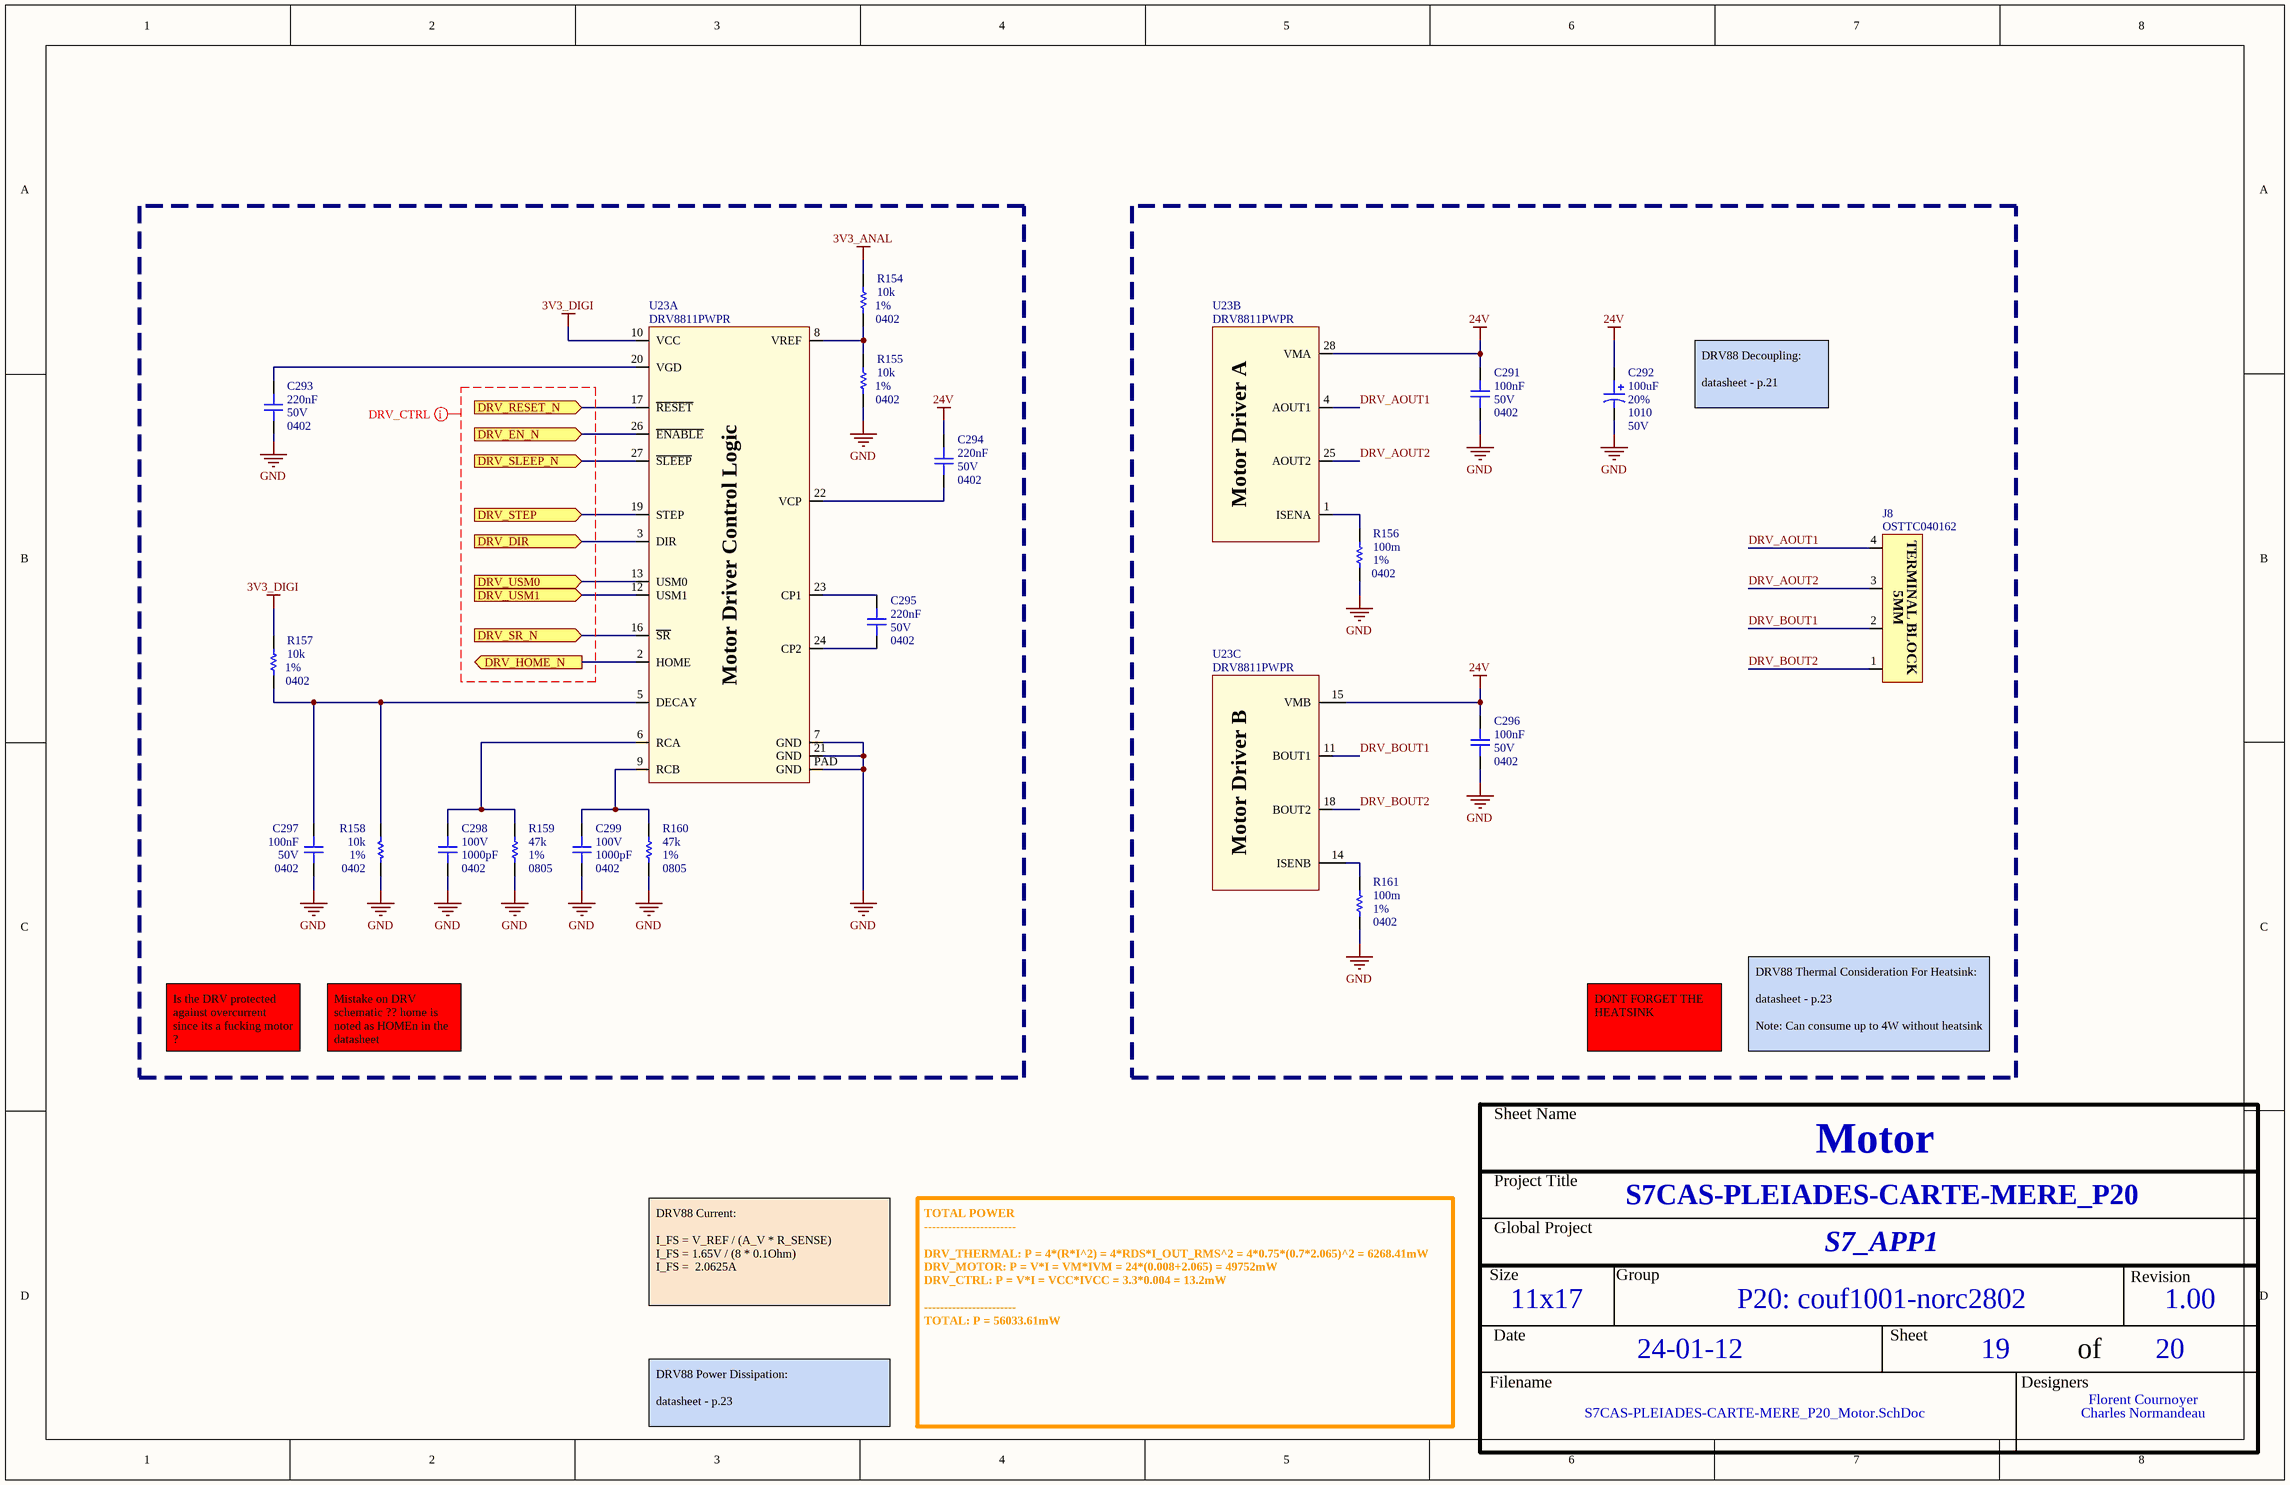
[diagram p18: S7CAS-PLEIADES-CARTE-MERE_P20_Motor.SchDoc]

### Parts
C291  value 100nF  Voltage: 50V  Package: 0402  [CAP_0402]  (hidden comment: CAP - 0402)
C292  value 100uF  Voltage: 50V  Package: 1010  Precision: 20%  [CAP_ALU_1010_vishay]  (hidden comment: MAL215099101E3)
C293  value 220nF  Voltage: 50V  Package: 0402  [CAP_0402]  (hidden comment: CAP - 0402)
C294  value 220nF  Voltage: 50V  Package: 0402  [CAP_0402]  (hidden comment: CAP - 0402)
C295  value 220nF  Voltage: 50V  Package: 0402  [CAP_0402]  (hidden comment: CAP - 0402)
C296  value 100nF  Voltage: 50V  Package: 0402  [CAP_0402]  (hidden comment: CAP - 0402)
C297  value 100nF  Voltage: 50V  Package: 0402  [CAP_0402]  (hidden comment: CAP - 0402)
C298  value 1000pF  Voltage: 100V  Package: 0402  [CAP_0402]  (hidden comment: CAP - 0402)
C299  value 1000pF  Voltage: 100V  Package: 0402  [CAP_0402]  (hidden comment: CAP - 0402)
J8  OSTTC040162  [CONN_TERMINAL_OSTTA040161]
R154  value 10k  Package: 0402  Precision: 1%  [RES_0402]  (hidden comment: RES - 0402)
R155  value 10k  Package: 0402  Precision: 1%  [RES_0402]  (hidden comment: RES - 0402)
R156  value 100m  Package: 0402  Precision: 1%  [RES_0402]  (hidden comment: RES - 0402)
R157  value 10k  Package: 0402  Precision: 1%  [RES_0402]  (hidden comment: RES - 0402)
R158  value 10k  Package: 0402  Precision: 1%  [RES_0402]  (hidden comment: RES - 0402)
R159  value 47k  Package: 0805  Precision: 1%  [RES_0402]  (hidden comment: RES - 0402)
R160  value 47k  Package: 0805  Precision: 1%  [RES_0402]  (hidden comment: RES - 0402)
R161  value 100m  Package: 0402  Precision: 1%  [RES_0402]  (hidden comment: RES - 0402)
U23  DRV8811PWPR  [POW_MOTOR_DRV8811PWPR]  (parts A,B,C of 3)

### Ports
DRV_DIR (in), DRV_EN_N (in), DRV_HOME_N (out), DRV_RESET_N (in), DRV_SLEEP_N (in), DRV_SR_N (in), DRV_STEP (in), DRV_USM0 (in), DRV_USM1 (in)

### Nets
3V3_ANAL: R154.2
3V3_DIGI: R157.2 U23.10(VCC)
24V: C291.2 C292.1 C294.2 C296.2 U23.15(VMB) U23.28(VMA)
GND: C291.1 C292.2 C293.1 C296.1 C297.1 C298.2 C299.2 R155.1 R156.1 R158.1 R159.1 R160.1 R161.1 U23.7(GND) U23.21(GND) U23.PAD(GND)
DRV_AOUT1: J8.4 U23.4(AOUT1)
DRV_AOUT2: J8.3 U23.25(AOUT2)
DRV_BOUT1: J8.2 U23.11(BOUT1)
DRV_BOUT2: J8.1 U23.18(BOUT2)
DRV_DIR: U23.3(DIR) ; port DRV_DIR
DRV_EN_N: U23.26(~{ENABLE}) ; port DRV_EN_N
DRV_HOME_N: U23.2(HOME) ; port DRV_HOME_N
DRV_RESET_N: U23.17(~{RESET}) ; port DRV_RESET_N
DRV_SLEEP_N: U23.27(~{SLEEP}) ; port DRV_SLEEP_N
DRV_SR_N: U23.16(~{SR}) ; port DRV_SR_N
DRV_STEP: U23.19(STEP) ; port DRV_STEP
DRV_USM0: U23.13(USM0) ; port DRV_USM0
DRV_USM1: U23.12(USM1) ; port DRV_USM1
NetC293_2: C293.2 U23.20(VGD)
NetC294_1: C294.1 U23.22(VCP)
NetC295_1: C295.1 U23.24(CP2)
NetC295_2: C295.2 U23.23(CP1)
NetC297_2: C297.2 R157.1 R158.2 U23.5(DECAY)
NetC298_1: C298.1 R159.2 U23.6(RCA)
NetC299_1: C299.1 R160.2 U23.9(RCB)
NetR154_1: R154.1 R155.2 U23.8(VREF)
NetR156_2: R156.2 U23.1(ISENA)
NetR161_2: R161.2 U23.14(ISENB)

### Layout directives
net class TRACKS_50: (no net found under the mark)

### Notes on the sheet
- DRV88 Decoupling:
  datasheet - p.21
- Is the DRV protected against overcurrent since its a fucking motor ?
- Mistake on DRV schematic ?? home is noted as HOMEn in the datasheet
- DONT FORGET THE HEATSINK
- DRV88 Thermal Consideration For Heatsink:
  datasheet - p.23
  Note: Can consume up to 4W without heatsink
- DRV88 Current:
  I_FS = V_REF / (A_V * R_SENSE)
  I_FS = 1.65V / (8 * 0.1Ohm)
  I_FS =  2.0625A
- DRV88 Power Dissipation:
  datasheet - p.23
- TOTAL POWER
  -----------------------
  DRV_THERMAL: P = 4*(R*I^2) = 4*RDS*I_OUT_RMS^2 = 4*0.75*(0.7*2.065)^2 = 6268.41mW
  DRV_MOTOR: P = V*I = VM*IVM = 24*(0.008+2.065) = 49752mW
  DRV_CTRL: P = V*I = VCC*IVCC = 3.3*0.004 = 13.2mW
  -----------------------
  TOTAL: P = 56033.61mW
- Sheet Name
- Project Title
- Global Project
- Size
- Group
- Revision
- Date
- Sheet
- of
- Filename
- Designers
- (in symbol CONN_TERMINAL_OSTTC040162) 5MM; TERMINAL BLOCK
- (in symbol POW_MOTOR_DRV8811PWPR, part A) Motor Driver Control Logic
- (in symbol POW_MOTOR_DRV8811PWPR, part B) Motor Driver A
- (in symbol POW_MOTOR_DRV8811PWPR, part C) Motor Driver B

### Library data of the parts
C291 C296 C297 = CAP - 0402: as C244 on sheet S7CAS-PLEIADES-CARTE-MERE_P20_ADC; Current: *; CreatedBy: Jonathan Bouchard; Power: *
C292 = CAP_ALU_MAL215099101E3: as C262 on sheet S7CAS-PLEIADES-CARTE-MERE_P20_DAC-ADC-Decoupling; Mfg Part Number: MAL215099101E3; HelpURL: http://www.vishay.com/docs/28395/150crz.pdf; CreatedBy: Jonathan Bouchard; Temperature: -55°C to 125°C; Power: *; Supplier 1: Digikey; Supplier Part Number 1: 4399PHDKR-ND
C293-C295 = CAP - 0402: Mfg Part Number: GRM155R61H224KE01; Precision: 10%; Current: *; CreatedBy: Jonathan Bouchard; Power: *
C298 C299 = CAP - 0402: as C226-C228 on sheet S7CAS-PLEIADES-CARTE-MERE_P20_DAC; Current: *; CreatedBy: Jonathan Bouchard; Power: *
J8 = CONN_TERMINAL_OSTTC040162: CONN -  TERMINAL BLOCK 4POS 5MM - TH; Mfg: On Shore Technology Inc.; Voltage: *; Current: *; Power: *; Mfg Part Number: OSTTC040162; HelpURL: http://www.on-shore.com/wp-content/uploads/2015/09/osttcxx0162.pdf; CreatedBy: Jonathan Bouchard; Temperature: -30°C ~ 105°C; Value: *; Precision: *; Package: TH-4; Supplier 1: Digikey; Supplier Part Number 1: ED2602-ND
R154 R155 R157 R158 = RES - 0402: Mfg Part Number: MCS04020C1002FE000; Voltage: 50V; Power: 1/2W; Current: *; CreatedBy: Jonathan Bouchard
R156 R161 = RES - 0402: Mfg Part Number: ERJ-2BWFR100X; Voltage: 50V; Power: 1/2W; Current: *; CreatedBy: Jonathan Bouchard
R159 R160 = RES - 0402: Mfg Part Number: CRCW080547K0FKECHP; Voltage: 50V; Power: 1/2W; Current: *; CreatedBy: Jonathan Bouchard
U23 = POW_MOTOR_DRV8811PWPR: POW - STEPPER MOTOR DRIVER - SOP-28; Voltage: 3 V ~ 5.5 V / 8 V ~ 38 V; Mfg: Texas Instrument; Current: *; Power: *; Mfg Part Number: DRV8811PWPR; HelpURL: http://www.ti.com/lit/ds/symlink/drv8811.pdf; CreatedBy: Jonathan Bouchard; Temperature: -40°C ~ 150°C (TJ); Value: *; Precision: *; Package: SOP-28; Supplier 1: Digikey; Supplier Part Number 1: 296-24591-1-ND

## Sheet S7CAS-PLEIADES-CARTE-MERE_P20_Passive-Components.SchDoc
size Tabloid; SheetNumber: 20; SheetTotal: 20; Sheet_Name: Insert name in Document Parameters; Size: 11x17
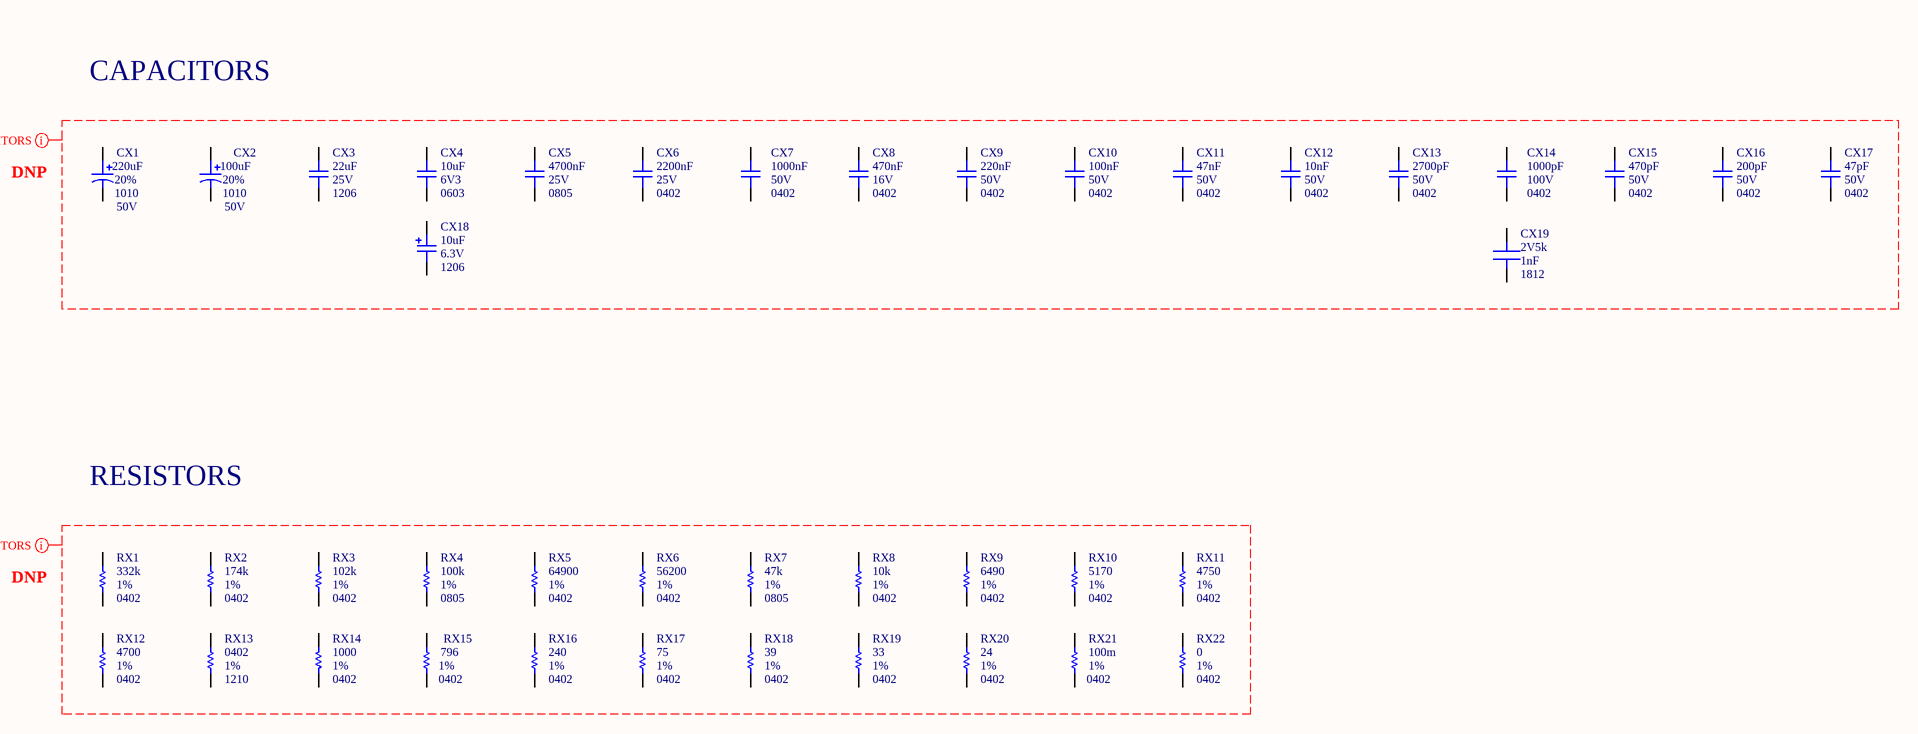
[diagram p19: S7CAS-PLEIADES-CARTE-MERE_P20_Passive-Components.SchDoc]

### Parts
CX1  value 220uF  Voltage: 50V  Package: 1010  Precision: 20%  [CAP_ALU_1010_vishay]  (hidden comment: MAL215099101E3)
CX2  value 100uF  Voltage: 50V  Package: 1010  Precision: 20%  [CAP_ALU_1010_vishay]  (hidden comment: MAL215099101E3)
CX3  value 22uF  Voltage: 25V  Package: 1206  [CAP_1206]  (hidden comment: CAP - 1206)
CX4  value 10uF  Voltage: 6V3  Package: 0603  [CAP_0603]  (hidden comment: CAP - 0603)
CX5  value 4700nF  Voltage: 25V  Package: 0805  [CAP_0805]  (hidden comment: CAP - 0805)
CX6  value 2200nF  Voltage: 25V  Package: 0402  [CAP_0402]  (hidden comment: CAP - 0402)
CX7  value 1000nF  Voltage: 50V  Package: 0402  [CAP_0402]  (hidden comment: CAP - 0402)
CX8  value 470nF  Voltage: 16V  Package: 0402  [CAP_0402]  (hidden comment: CAP - 0402)
CX9  value 220nF  Voltage: 50V  Package: 0402  [CAP_0402]  (hidden comment: CAP - 0402)
CX10  value 100nF  Voltage: 50V  Package: 0402  [CAP_0402]  (hidden comment: CAP - 0402)
CX11  value 47nF  Voltage: 50V  Package: 0402  [CAP_0402]  (hidden comment: CAP - 0402)
CX12  value 10nF  Voltage: 50V  Package: 0402  [CAP_0402]  (hidden comment: CAP - 0402)
CX13  value 2700pF  Voltage: 50V  Package: 0402  [CAP_0402]  (hidden comment: CAP - 0402)
CX14  value 1000pF  Voltage: 100V  Package: 0402  [CAP_0402]  (hidden comment: CAP - 0402)
CX15  value 470pF  Voltage: 50V  Package: 0402  [CAP_0402]  (hidden comment: CAP - 0402)
CX16  value 200pF  Voltage: 50V  Package: 0402  [CAP_0402]  (hidden comment: CAP - 0402)
CX17  value 47pF  Voltage: 50V  Package: 0402  [CAP_0402]  (hidden comment: CAP - 0402)
CX18  value 10uF  Voltage: 6.3V  Package: 1206  [CAP_TAN_1206(A)]  (hidden comment: CAP - TANTALUM - CASE A)
CX19  value 1nF  Package: 1812  Voltage Rating: 2V5k  [CAP_CER_1812]  (hidden comment: 1812WC102KAT1A)
RX1  value 332k  Package: 0402  Precision: 1%  [RES_0402]  (hidden comment: RES - 0402)
RX2  value 174k  Package: 0402  Precision: 1%  [RES_0402]  (hidden comment: RES - 0402)
RX3  value 102k  Package: 0402  Precision: 1%  [RES_0402]  (hidden comment: RES - 0402)
RX4  value 100k  Package: 0805  Precision: 1%  [RES_0805]  (hidden comment: RES - 0805)
RX5  value 64900  Package: 0402  Precision: 1%  [RES_0402]  (hidden comment: RES - 0402)
RX6  value 56200  Package: 0402  Precision: 1%  [RES_0402]  (hidden comment: RES - 0402)
RX7  value 47k  Package: 0805  Precision: 1%  [RES_0402]  (hidden comment: RES - 0402)
RX8  value 10k  Package: 0402  Precision: 1%  [RES_0402]  (hidden comment: RES - 0402)
RX9  value 6490  Package: 0402  Precision: 1%  [RES_0402]  (hidden comment: RES - 0402)
RX10  value 5170  Package: 0402  Precision: 1%  [RES_0402]  (hidden comment: RES - 0402)
RX11  value 4750  Package: 0402  Precision: 1%  [RES_0402]  (hidden comment: RES - 0402)
RX12  value 4700  Package: 0402  Precision: 1%  [RES_0402]  (hidden comment: RES - 0402)
RX13  value 1210  Package: 0402  Precision: 1%  [RES_0402]  (hidden comment: RES - 0402)
RX14  value 1000  Package: 0402  Precision: 1%  [RES_0402]  (hidden comment: RES - 0402)
RX15  value 796  Package: 0402  Precision: 1%  [RES_0402]  (hidden comment: RES - 0402)
RX16  value 240  Package: 0402  Precision: 1%  [RES_0402]  (hidden comment: RES - 0402)
RX17  value 75  Package: 0402  Precision: 1%  [RES_0402]  (hidden comment: RES - 0402)
RX18  value 39  Package: 0402  Precision: 1%  [RES_0402]  (hidden comment: RES - 0402)
RX19  value 33  Package: 0402  Precision: 1%  [RES_0402]  (hidden comment: RES - 0402)
RX20  value 24  Package: 0402  Precision: 1%  [RES_0402]  (hidden comment: RES - 0402)
RX21  value 100m  Package: 0402  Precision: 1%  [RES_0402]  (hidden comment: RES - 0402)
RX22  value 0  Package: 0402  Precision: 1%  [RES_0402]  (hidden comment: RES - 0402)

### Nets

Not connected (* = marked no-connect by the designer): CX1 1 2; CX2 1 2; CX3 1 2; CX4 1 2; CX5 1 2; CX6 1 2; CX7 1 2; CX8 1 2; CX9 1 2; CX10 1 2; CX11 1 2; CX12 1 2; CX13 1 2; CX14 1 2; CX15 1 2; CX16 1 2; CX17 1 2; CX18 1 2; CX19 1 2; RX1 1 2; RX2 1 2; RX3 1 2; RX4 1 2; RX5 1 2; RX6 1 2; RX7 1 2; RX8 1 2; RX9 1 2; RX10 1 2; RX11 1 2; RX12 1 2; RX13 1 2; RX14 1 2; RX15 1 2; RX16 1 2; RX17 1 2; RX18 1 2; RX19 1 2; RX20 1 2; RX21 1 2; RX22 1 2

### Layout directives
CompClassName: DNP: (no net found under the mark)

### Notes on the sheet
- CAPACITORS
- DNP
- RESISTORS
- Sheet Name
- Project Title
- Global Project
- Size
- Group
- Revision
- Date
- Sheet
- of
- Filename
- Designers

### Library data of the parts
CX1 CX2 = CAP_ALU_MAL215099101E3: as C262 on sheet S7CAS-PLEIADES-CARTE-MERE_P20_DAC-ADC-Decoupling; Mfg Part Number: MAL215099101E3; HelpURL: http://www.vishay.com/docs/28395/150crz.pdf; CreatedBy: Jonathan Bouchard; Temperature: -55°C to 125°C; Power: *; Supplier 1: Digikey; Supplier Part Number 1: 4399PHDKR-ND
CX3 = CAP - 1206: Mfg Part Number: GRM31CC81E226KE11; Precision: 10%; Current: *; HelpURL: https://search.murata.co.jp/Ceramy/image/img/A01X/G101/ENG/GRM31CD71H106KE11-01A.pdf; CreatedBy: Jonathan Bouchard; Power: *
CX4 = CAP - 0603: Mfg Part Number: GRM185R60J106ME15; Precision: 20%; Current: *; CreatedBy: Jonathan Bouchard; Power: *
CX5 = CAP - 0805: as C261 on sheet S7CAS-PLEIADES-CARTE-MERE_P20_DAC-ADC-Decoupling; Current: *; CreatedBy: Jonathan Bouchard; Power: *
CX6 = CAP - 0402: Mfg Part Number: GRM155R61E225KE11; Precision: 10%; Current: *; CreatedBy: Jonathan Bouchard; Power: *
CX7 = CAP - 0402: Mfg Part Number: GXT155R61E105KE01; Precision: 10%; Current: *; CreatedBy: Jonathan Bouchard; Power: *
CX8 = CAP - 0402: Mfg Part Number: GXT155R61C474KE01; Precision: 10%; Current: *; CreatedBy: Jonathan Bouchard; Power: *
CX9 = CAP - 0402: as C293 on sheet S7CAS-PLEIADES-CARTE-MERE_P20_Motor; Current: *; CreatedBy: Jonathan Bouchard; Power: *
CX10 = CAP - 0402: as C244 on sheet S7CAS-PLEIADES-CARTE-MERE_P20_ADC; Current: *; CreatedBy: Jonathan Bouchard; Power: *
CX11 = CAP - 0402: Mfg Part Number: GRM155R61H473KE14; Precision: 10%; Current: *; CreatedBy: Jonathan Bouchard; Power: *
CX12 = CAP - 0402: Mfg Part Number: GCM155R71H103KA55; Precision: 10%; Current: *; CreatedBy: Jonathan Bouchard; Power: *
CX13 = CAP - 0402: as C255 on sheet S7CAS-PLEIADES-CARTE-MERE_P20_DAC-ADC-Decoupling; Current: *; CreatedBy: Jonathan Bouchard; Power: *
CX14 = CAP - 0402: as C226-C228 on sheet S7CAS-PLEIADES-CARTE-MERE_P20_DAC; Current: *; CreatedBy: Jonathan Bouchard; Power: *
CX15 = CAP - 0402: as C264-C266 on sheet S7CAS-PLEIADES-CARTE-MERE_P20_DAC-ADC-Decoupling; Current: *; HelpURL: https://search.murata.co.jp/Ceramy/image/img/A01X/G101/ENG/GRM1555C1H471GA01-01.pdf; CreatedBy: Jonathan Bouchard; Power: *
CX16 = CAP - 0402: Mfg Part Number: GCM1555G1H201GA16; Precision: 10%; Current: *; CreatedBy: Jonathan Bouchard; Power: *
CX17 = CAP - 0402: as C246 on sheet S7CAS-PLEIADES-CARTE-MERE_P20_ADC; Current: *; CreatedBy: Jonathan Bouchard; Power: *
CX18 = CAP_TANT_1206(A): as C243 on sheet S7CAS-PLEIADES-CARTE-MERE_P20_ADC; Current: *; HelpURL: TBD; CreatedBy: Jonathan Bouchard; Power: *
CX19 = CAP_CER_1812WC102KAT1A: CAP - CER 1000PF 2.5KV X7R - 1812; Tolerance: 10%; GRAMS Lib Spec: 2.7; Temperature: -55 to 125C; Mfg Part Number: 1812WC102KAT1A
RX1 = RES - 0402: Mfg Part Number: RK73H1FTTBL3323F; Voltage: 50V; Power: 1/32W; Current: *; CreatedBy: Jonathan Bouchard
RX2 = RES - 0402: Mfg Part Number: CRCW0402174KFKEDC; Voltage: 50V; Power: 1/16W; Current: *; CreatedBy: Jonathan Bouchard
RX3 = RES - 0402: Mfg Part Number: RMCF0402FT102K; Voltage: 50V; Power: 1/16W; Current: *; CreatedBy: Jonathan Bouchard
RX4 = RES - 0805: Mfg Part Number: CRM0805-FX-1003ELF; Current: *; CreatedBy: Jonathan Bouchard
RX5 = RES - 0402: Mfg Part Number: RMCF0402FT64K9; Voltage: 50V; Power: 1/16W; Current: *; CreatedBy: Jonathan Bouchard
RX6 = RES - 0402: Voltage: 50V; Mfg: RS73F1ERTTP5622F; Power: 1/8W; Current: *; CreatedBy: Jonathan Bouchard
RX7 = RES - 0402: as R159 on sheet S7CAS-PLEIADES-CARTE-MERE_P20_Motor; Current: *; CreatedBy: Jonathan Bouchard
RX8 = RES - 0402: as R154 on sheet S7CAS-PLEIADES-CARTE-MERE_P20_Motor; Current: *; CreatedBy: Jonathan Bouchard
RX9 = RES - 0402: Mfg Part Number: CRCW04026K49FKEDC; Voltage: 50V; Power: 1/16W; Current: *; CreatedBy: Jonathan Bouchard
RX10 = RES - 0402: Mfg Part Number: RN73H1ETTP5171F50; Voltage: 50V; Power: 1/16W; Current: *; CreatedBy: Jonathan Bouchard
RX11 = RES - 0402: Mfg Part Number: CR0402-FX-4751GLF; Voltage: 50V; Power: 1/16W; Current: *; CreatedBy: Jonathan Bouchard
RX12 = RES - 0402: Mfg Part Number: TBD; Voltage: 50V; Power: 1/16W; Current: *; CreatedBy: Jonathan Bouchard
RX13 = RES - 0402: Mfg Part Number: CRCW04021K21FKEDC; Voltage: 50V; Power: 1/16W; Current: *; CreatedBy: Jonathan Bouchard
RX14 = RES - 0402: Mfg Part Number: MCS04020C1001FE000; Voltage: 50V; Power: 1/16W; Current: *; CreatedBy: Jonathan Bouchard
RX15 = RES - 0402: Mfg Part Number: RN73H1ETTP7960F50; Voltage: 50V; Power: 1/16W; Current: *; CreatedBy: Jonathan Bouchard
RX16 = RES - 0402: Mfg Part Number: ERA-2AEB241X; Voltage: 50V; Power: 1/2W; Current: *; CreatedBy: Jonathan Bouchard
RX17 = RES - 0402: Mfg Part Number: SG73P; Voltage: 50V; Power: 1/16W; Current: *; CreatedBy: Jonathan Bouchard
RX18 = RES - 0402: as R152 on sheet S7CAS-PLEIADES-CARTE-MERE_P20_ADC; Current: *; CreatedBy: Jonathan Bouchard
RX19 = RES - 0402: as R138 on sheet S7CAS-PLEIADES-CARTE-MERE_P20_ADC; Current: *; CreatedBy: Jonathan Bouchard
RX20 = RES - 0402: as R139 on sheet S7CAS-PLEIADES-CARTE-MERE_P20_ADC; Current: *; CreatedBy: Jonathan Bouchard
RX21 = RES - 0402: as R156 on sheet S7CAS-PLEIADES-CARTE-MERE_P20_Motor; Current: *; CreatedBy: Jonathan Bouchard
RX22 = RES - 0402: Mfg Part Number: CR200000F; Voltage: 50V; Power: 1/16W; Current: *; CreatedBy: Jonathan Bouchard